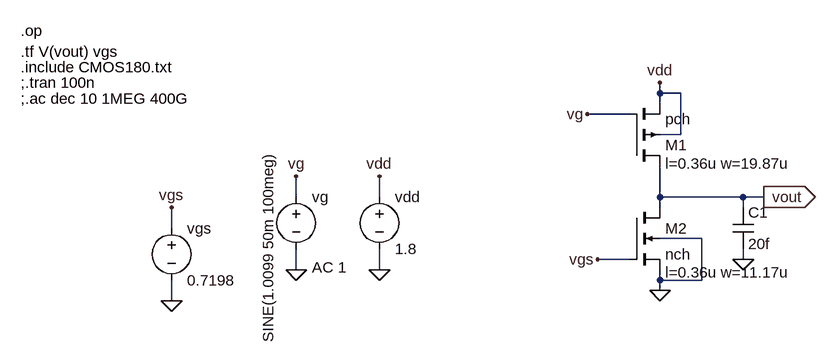
[diagram p0: schematic cs pmos current source loadne2.asc]
cs pmos current source loadne2.asc, the LTspice schematic file:
Version 4
SHEET 1 880 680
WIRE 560 -32 560 -48
WIRE 592 -32 560 -32
WIRE 560 -16 560 -32
WIRE 512 0 448 0
WIRE 592 32 592 -32
WIRE 592 32 560 32
WIRE 0 128 0 96
WIRE 128 128 128 96
WIRE 560 128 560 80
WIRE 688 128 560 128
WIRE 720 128 688 128
WIRE 560 144 560 128
WIRE 688 144 688 128
WIRE -192 176 -192 144
WIRE 624 192 560 192
WIRE 512 224 464 224
WIRE 688 224 688 208
WIRE 0 240 0 208
WIRE 128 240 128 208
WIRE 560 256 560 240
WIRE 624 256 624 192
WIRE 624 256 560 256
WIRE 560 272 560 256
WIRE -192 288 -192 256
FLAG 128 240 0
FLAG 128 96 vdd
FLAG 560 -48 vdd
FLAG 0 240 0
FLAG 0 96 vg
FLAG 448 0 vg
FLAG 720 128 vout
IOPIN 720 128 Out
FLAG 560 272 0
FLAG 464 224 vgs
FLAG -192 288 0
FLAG -192 144 vgs
FLAG 688 224 0
SYMBOL pmos4 512 80 M180
WINDOW 123 56 4 Left 2
SYMATTR Value2 l=0.36u w=19.87u
SYMATTR InstName M1
SYMATTR Value pch
SYMBOL voltage 128 112 R0
WINDOW 123 0 0 Left 0
WINDOW 39 0 0 Left 0
SYMATTR InstName vdd
SYMATTR Value 1.8
SYMBOL voltage 0 112 R0
WINDOW 123 24 124 Left 2
WINDOW 39 0 0 Left 0
WINDOW 3 -43 -55 VRight 2
SYMATTR Value2 AC 1
SYMATTR Value SINE(1.0099 50m 100meg)
SYMATTR InstName vg
SYMBOL nmos4 512 144 R0
WINDOW 123 56 100 Left 2
SYMATTR Value2 l=0.36u w=11.17u
SYMATTR InstName M2
SYMATTR Value nch
SYMBOL voltage -192 160 R0
WINDOW 123 0 0 Left 0
WINDOW 39 0 0 Left 0
SYMATTR InstName vgs
SYMATTR Value 0.7198
SYMBOL cap 672 144 R0
SYMATTR InstName C1
SYMATTR Value 20f
TEXT -424 -72 Left 2 !.include CMOS180.txt
TEXT -424 -128 Left 2 !.op
TEXT -424 -96 Left 2 !.tf V(vout) vgs
TEXT -424 -48 Left 2 !;.tran 100n
TEXT -424 -24 Left 2 !;.ac dec 10 1MEG 400G

The netlist it stands for:
* cs pmos current source loadne2.asc
M1 vout vg vdd vdd pch l=0.36u w=19.87u
vdd vdd 0 1.8
vg vg 0 SINE(1.0099 50m 100meg) AC 1
M2 vout vgs 0 0 nch l=0.36u w=11.17u
vgs vgs 0 0.7198
C1 vout 0 20f
.model NMOS NMOS
.model PMOS PMOS
.lib standard.mos
.include CMOS180.txt
.op
.tf V(vout) vgs
;.tran 100n
;.ac dec 10 1MEG 400G
.backanno
.end